# EAGLE design XMICRO-LPA V1.0 (EAGLE 6.3)
PROJECT_NAME: XMICRO-LPA; PROJECT_REVISION: 1.0
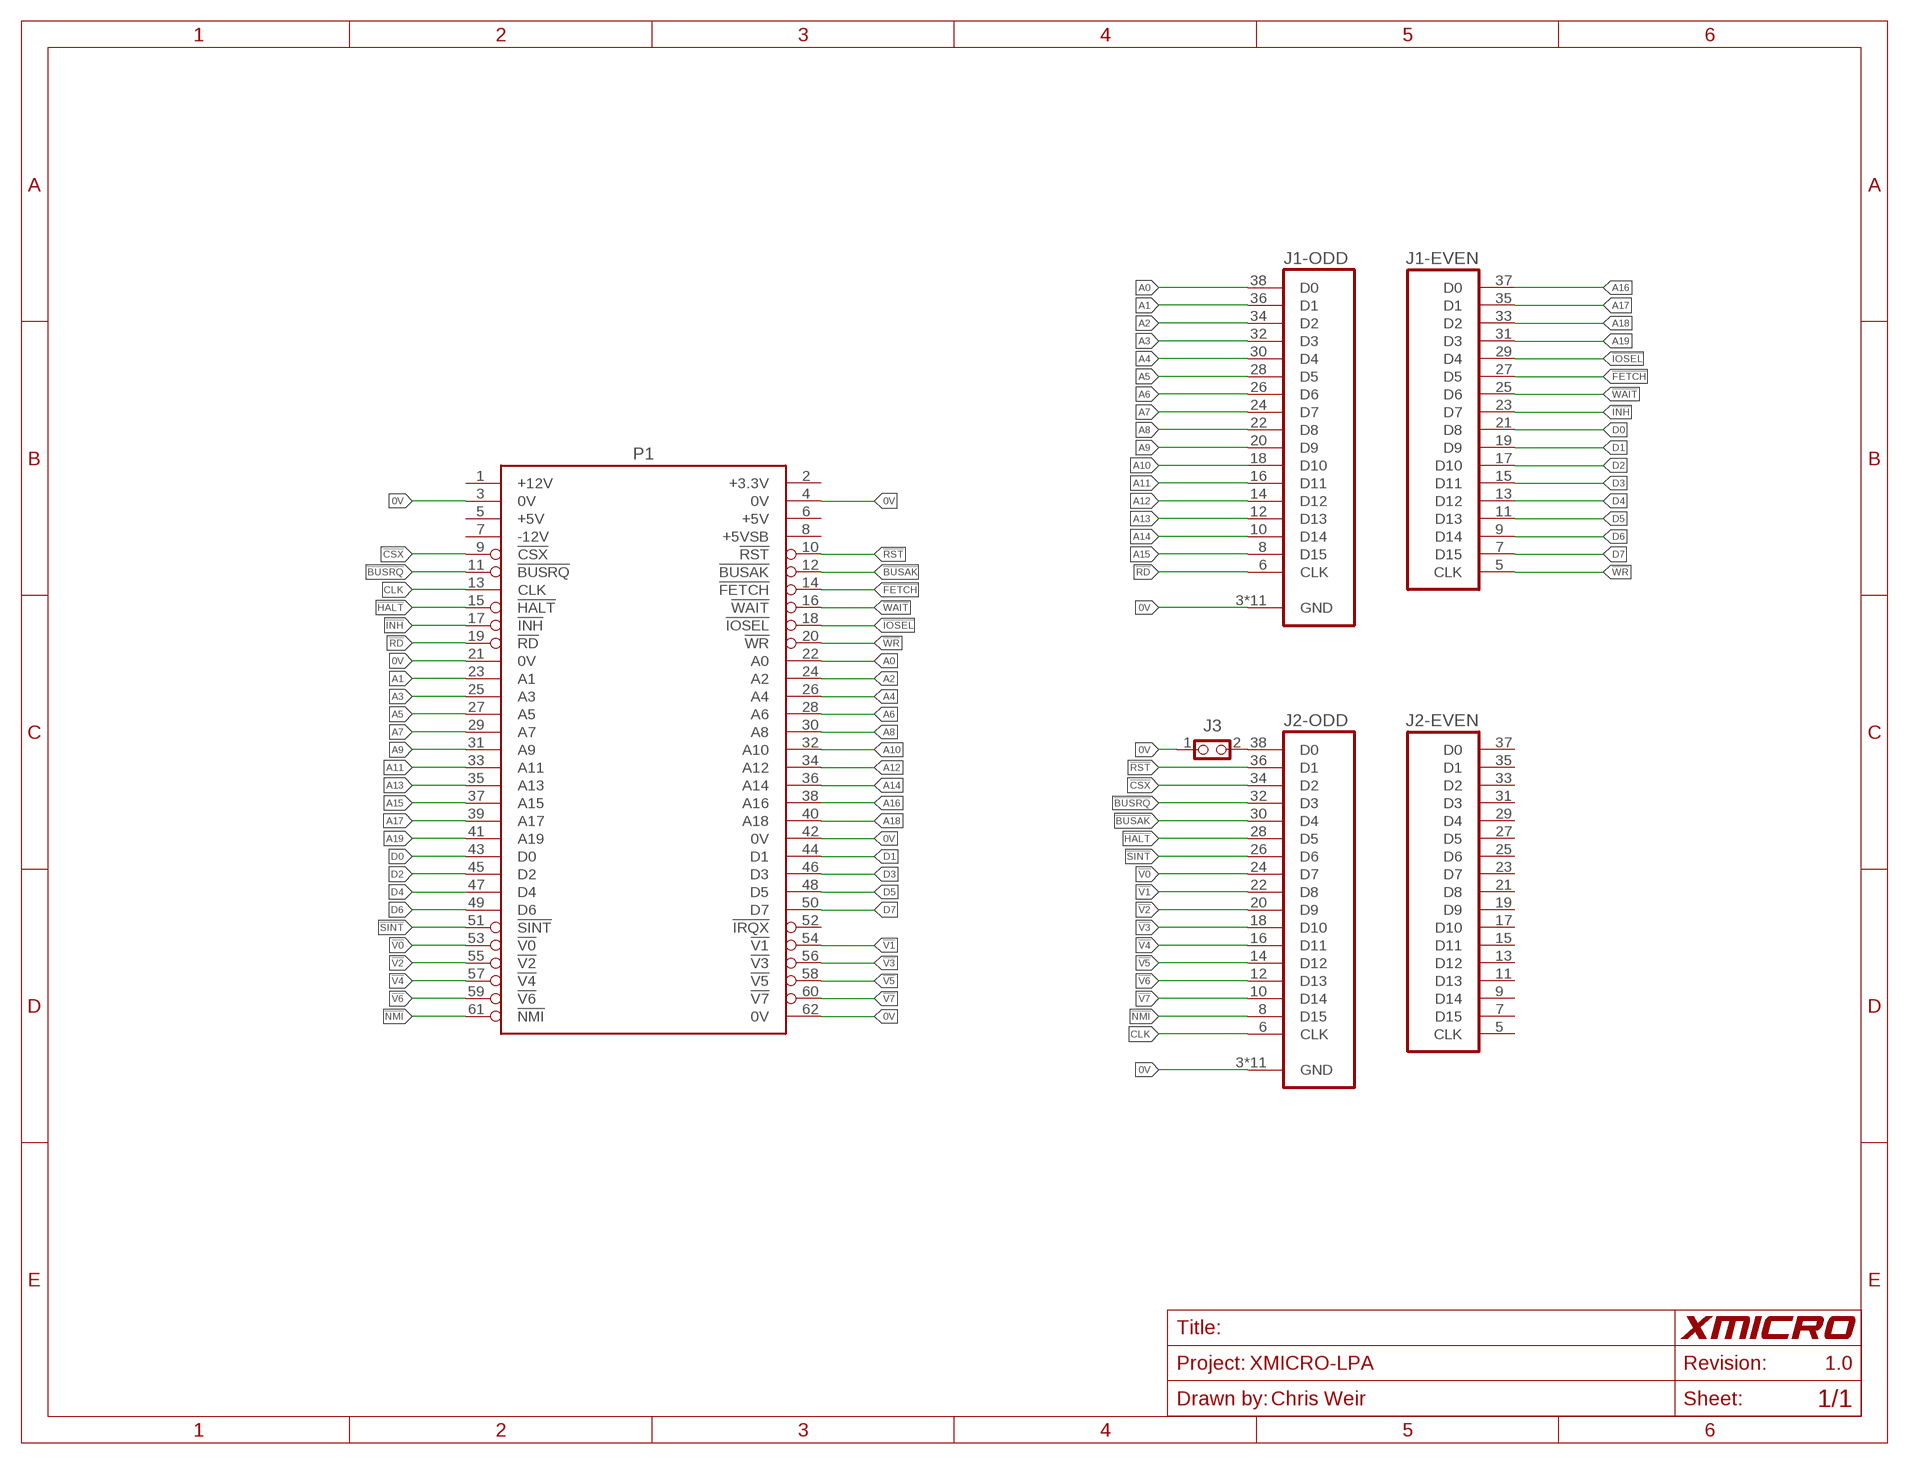
[diagram p0: schematic, sheet 1]
FRAME1 (LETTER): DRAWN_BY: Chris Weir

## Parts
J1  LA-34MEB  [5767089-1B]
J2  LA-34MEB  [5767089-1B]
J3  1X2-THRU  [1X2]
P1  XMICRO-BUS-PHYSICAL-M  [EDGE62M]

## Nets
0V [SUPPLY]: J1.3(-ODD:GND) J1.G1(-ODD:GND) J1.G2(-ODD:GND) J1.G3(-ODD:GND) J1.G4(-ODD:GND) J1.G5(-ODD:GND) J1.G6(-ODD:GND) J1.G7(-ODD:GND) J1.G8(-ODD:GND) J1.G9(-ODD:GND) J1.G10(-ODD:GND) J2.3(-ODD:GND) J2.G1(-ODD:GND) J2.G2(-ODD:GND) J2.G3(-ODD:GND) J2.G4(-ODD:GND) J2.G5(-ODD:GND) J2.G6(-ODD:GND) J2.G7(-ODD:GND) J2.G8(-ODD:GND) J2.G9(-ODD:GND) J2.G10(-ODD:GND) J3.1 P1.3(0V) P1.4(0V) P1.21(0V) P1.42(0V) P1.62(0V)
!BUSAK: J2.30(-ODD:D4) P1.12(!BUSAK)
!BUSRQ: J2.32(-ODD:D3) P1.11(!BUSRQ)
!CSX: J2.34(-ODD:D2) P1.9(!CSX)
!FETCH: J1.27(-EVEN:D5) P1.14(!FETCH)
!HALT: J2.28(-ODD:D5) P1.15(!HALT)
!INH: J1.23(-EVEN:D7) P1.17(!INH)
!IOSEL: J1.29(-EVEN:D4) P1.18(!IOSEL)
!NMI: J2.8(-ODD:D15) P1.61(!NMI)
!RD: J1.6(-ODD:CLK) P1.19(!RD)
!RST: J2.36(-ODD:D1) P1.10(!RST)
!SINT: J2.26(-ODD:D6) P1.51(!SINT)
!V0: J2.24(-ODD:D7) P1.53(!V0)
!V1: J2.22(-ODD:D8) P1.54(!V1)
!V2: J2.20(-ODD:D9) P1.55(!V2)
!V3: J2.18(-ODD:D10) P1.56(!V3)
!V4: J2.16(-ODD:D11) P1.57(!V4)
!V5: J2.14(-ODD:D12) P1.58(!V5)
!V6: J2.12(-ODD:D13) P1.59(!V6)
!V7: J2.10(-ODD:D14) P1.60(!V7)
!WAIT: J1.25(-EVEN:D6) P1.16(!WAIT)
!WR: J1.5(-EVEN:CLK) P1.20(!WR)
A0: J1.38(-ODD:D0) P1.22(A0)
A1: J1.36(-ODD:D1) P1.23(A1)
A2: J1.34(-ODD:D2) P1.24(A2)
A3: J1.32(-ODD:D3) P1.25(A3)
A4: J1.30(-ODD:D4) P1.26(A4)
A5: J1.28(-ODD:D5) P1.27(A5)
A6: J1.26(-ODD:D6) P1.28(A6)
A7: J1.24(-ODD:D7) P1.29(A7)
A8: J1.22(-ODD:D8) P1.30(A8)
A9: J1.20(-ODD:D9) P1.31(A9)
A10: J1.18(-ODD:D10) P1.32(A10)
A11: J1.16(-ODD:D11) P1.33(A11)
A12: J1.14(-ODD:D12) P1.34(A12)
A13: J1.12(-ODD:D13) P1.35(A13)
A14: J1.10(-ODD:D14) P1.36(A14)
A15: J1.8(-ODD:D15) P1.37(A15)
A16: J1.37(-EVEN:D0) P1.38(A16)
A17: J1.35(-EVEN:D1) P1.39(A17)
A18: J1.33(-EVEN:D2) P1.40(A18)
A19: J1.31(-EVEN:D3) P1.41(A19)
CLK: J2.6(-ODD:CLK) P1.13(CLK)
D0: J1.21(-EVEN:D8) P1.43(D0)
D1: J1.19(-EVEN:D9) P1.44(D1)
D2: J1.17(-EVEN:D10) P1.45(D2)
D3: J1.15(-EVEN:D11) P1.46(D3)
D4: J1.13(-EVEN:D12) P1.47(D4)
D5: J1.11(-EVEN:D13) P1.48(D5)
D6: J1.9(-EVEN:D14) P1.49(D6)
D7: J1.7(-EVEN:D15) P1.50(D7)
N$2: J2.38(-ODD:D0) J3.2
Unconnected: J2.5(-EVEN:CLK) J2.7(-EVEN:D15) J2.9(-EVEN:D14) J2.11(-EVEN:D13) J2.13(-EVEN:D12) J2.15(-EVEN:D11) J2.17(-EVEN:D10) J2.19(-EVEN:D9) J2.21(-EVEN:D8) J2.23(-EVEN:D7) J2.25(-EVEN:D6) J2.27(-EVEN:D5) J2.29(-EVEN:D4) J2.31(-EVEN:D3) J2.33(-EVEN:D2) J2.35(-EVEN:D1) J2.37(-EVEN:D0) P1.1(+12V) P1.2(+3.3V) P1.5(+5V) P1.6(+5V) P1.7(-12V) P1.8(+5VSB) P1.52(!IRQX)

## Library data of the parts
J1 J2 = connector-misc:LA-34: Agilent Logic Analyzer Probe - Dual-Pod
J3 = header:1X2-THRU
P1 = xmicro:XMICRO-BUS-PHYSICAL: XMICRO Bus Symbol with physical pin arrangement

## Net classes
1 SUPPLY: width 0.254 mm, clearance 0.203 mm

## Board
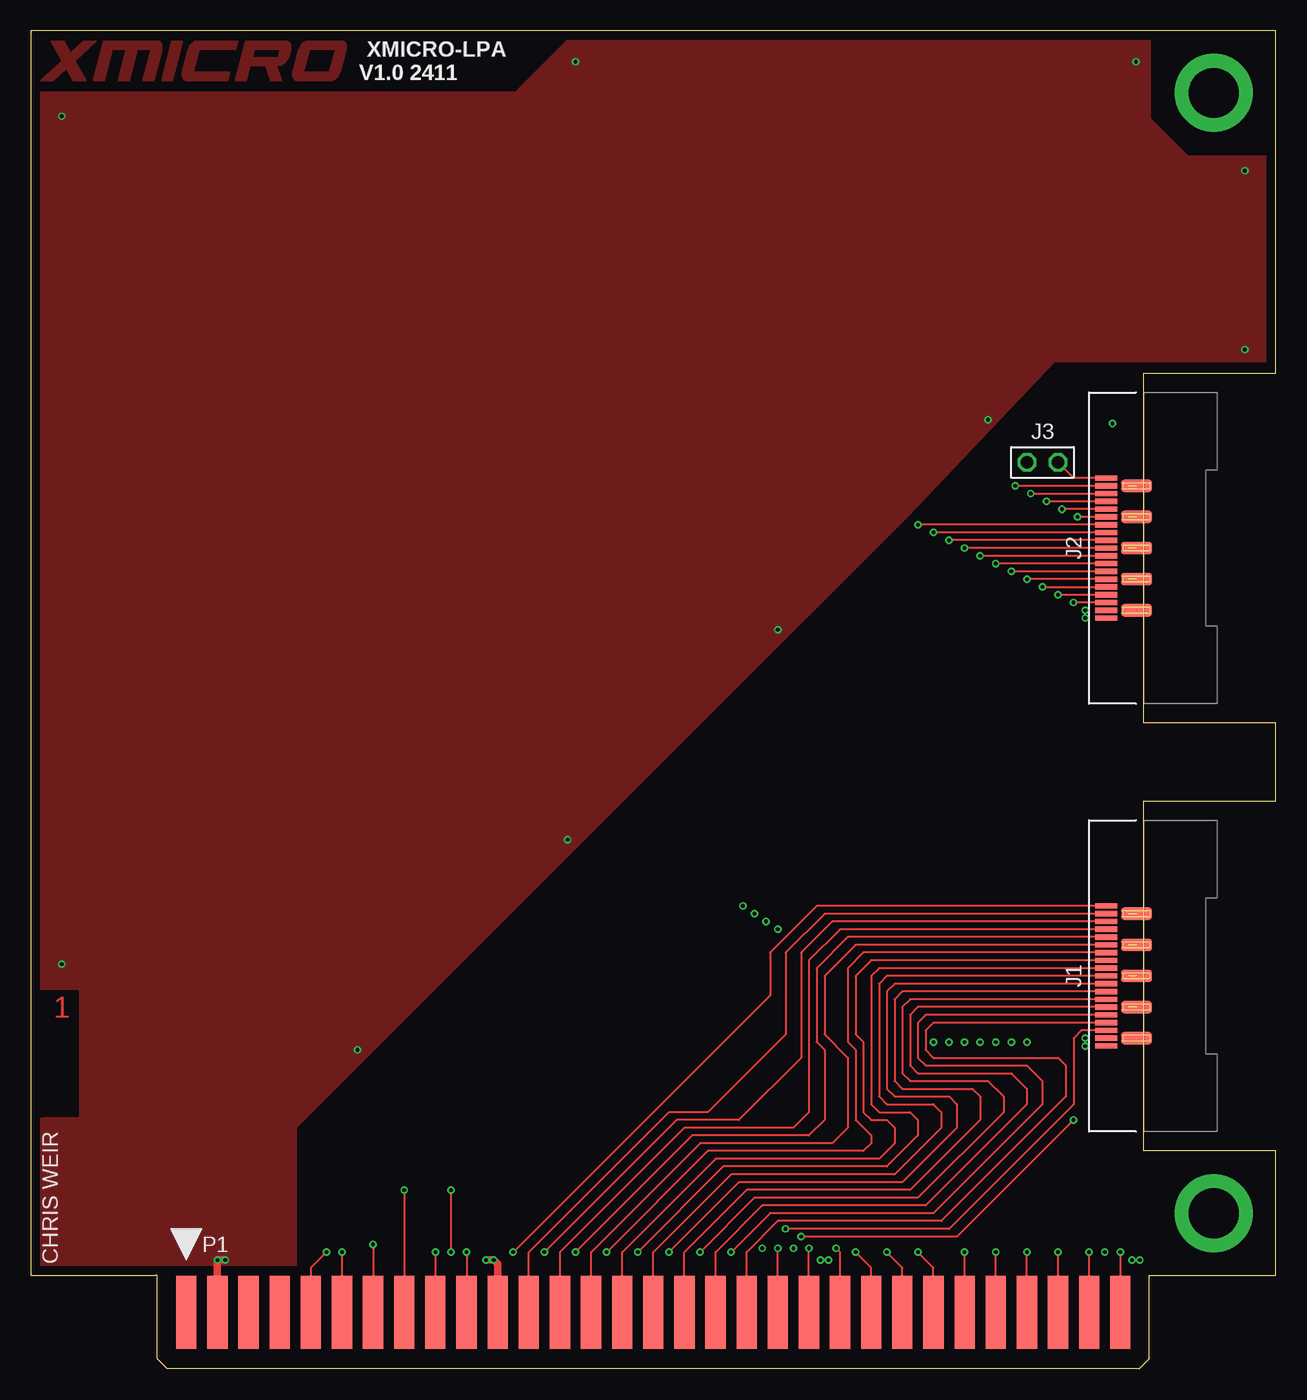
[diagram p1: board, top side]
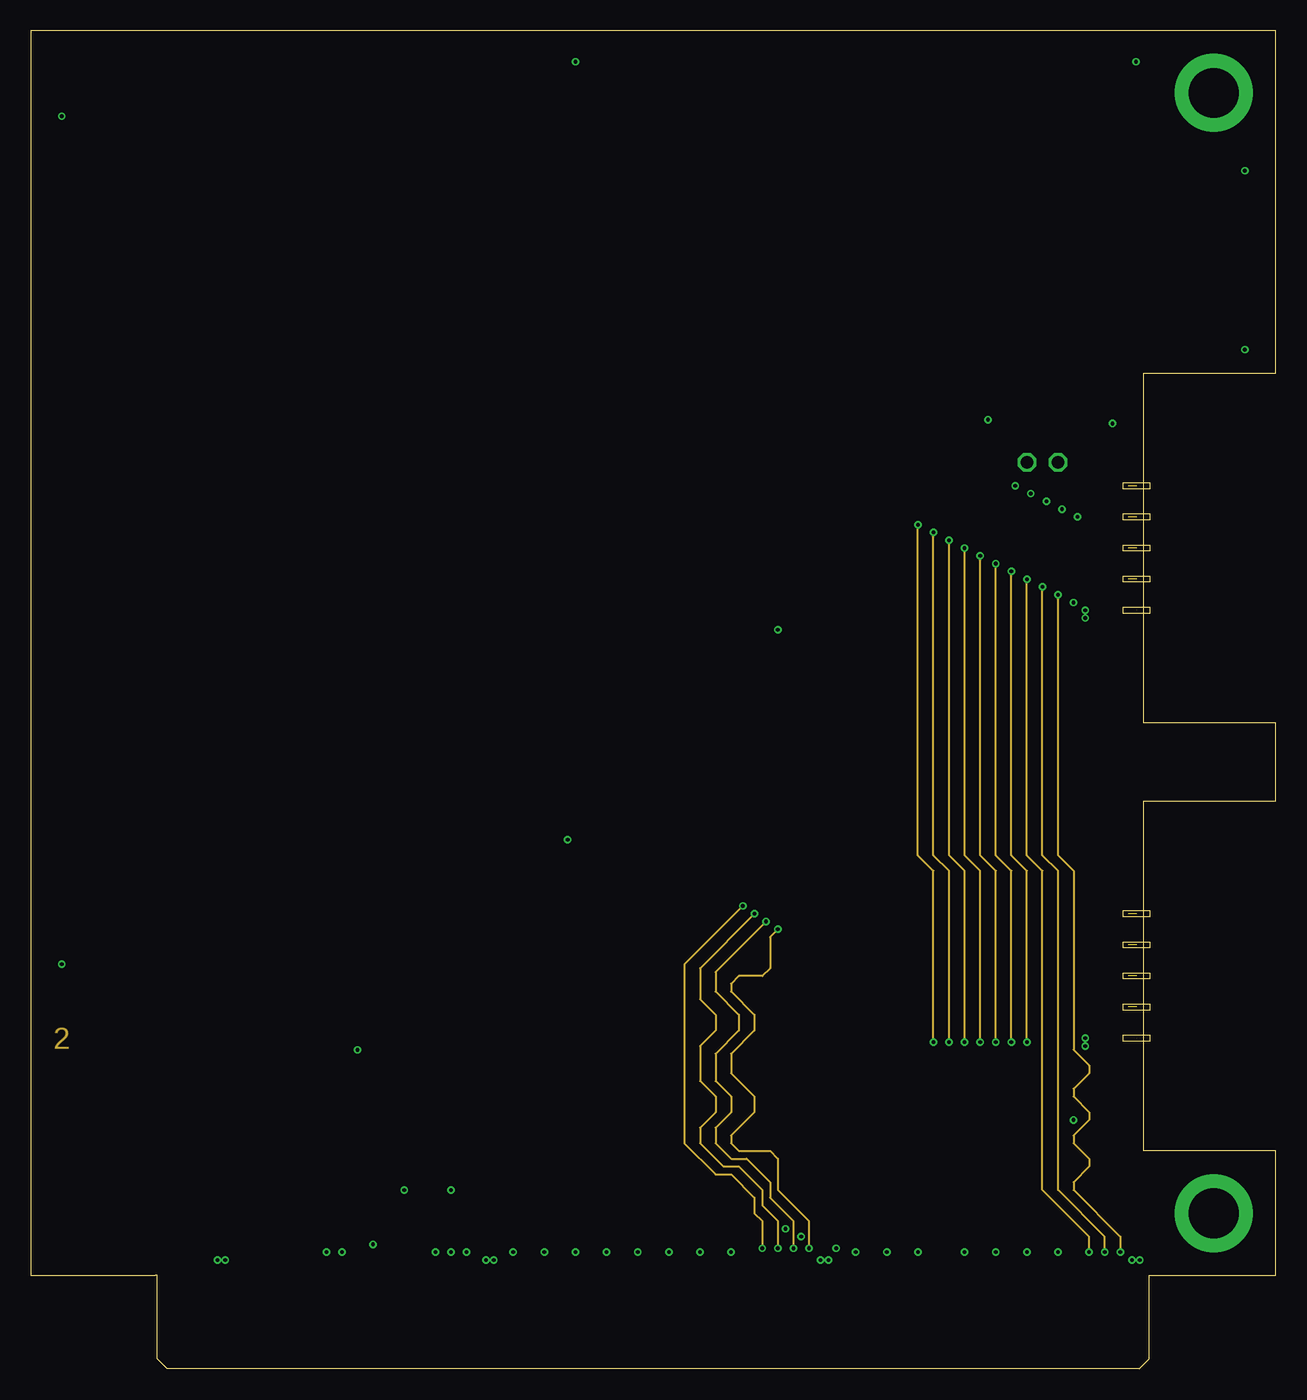
[diagram p2: board, inner layer Route2]
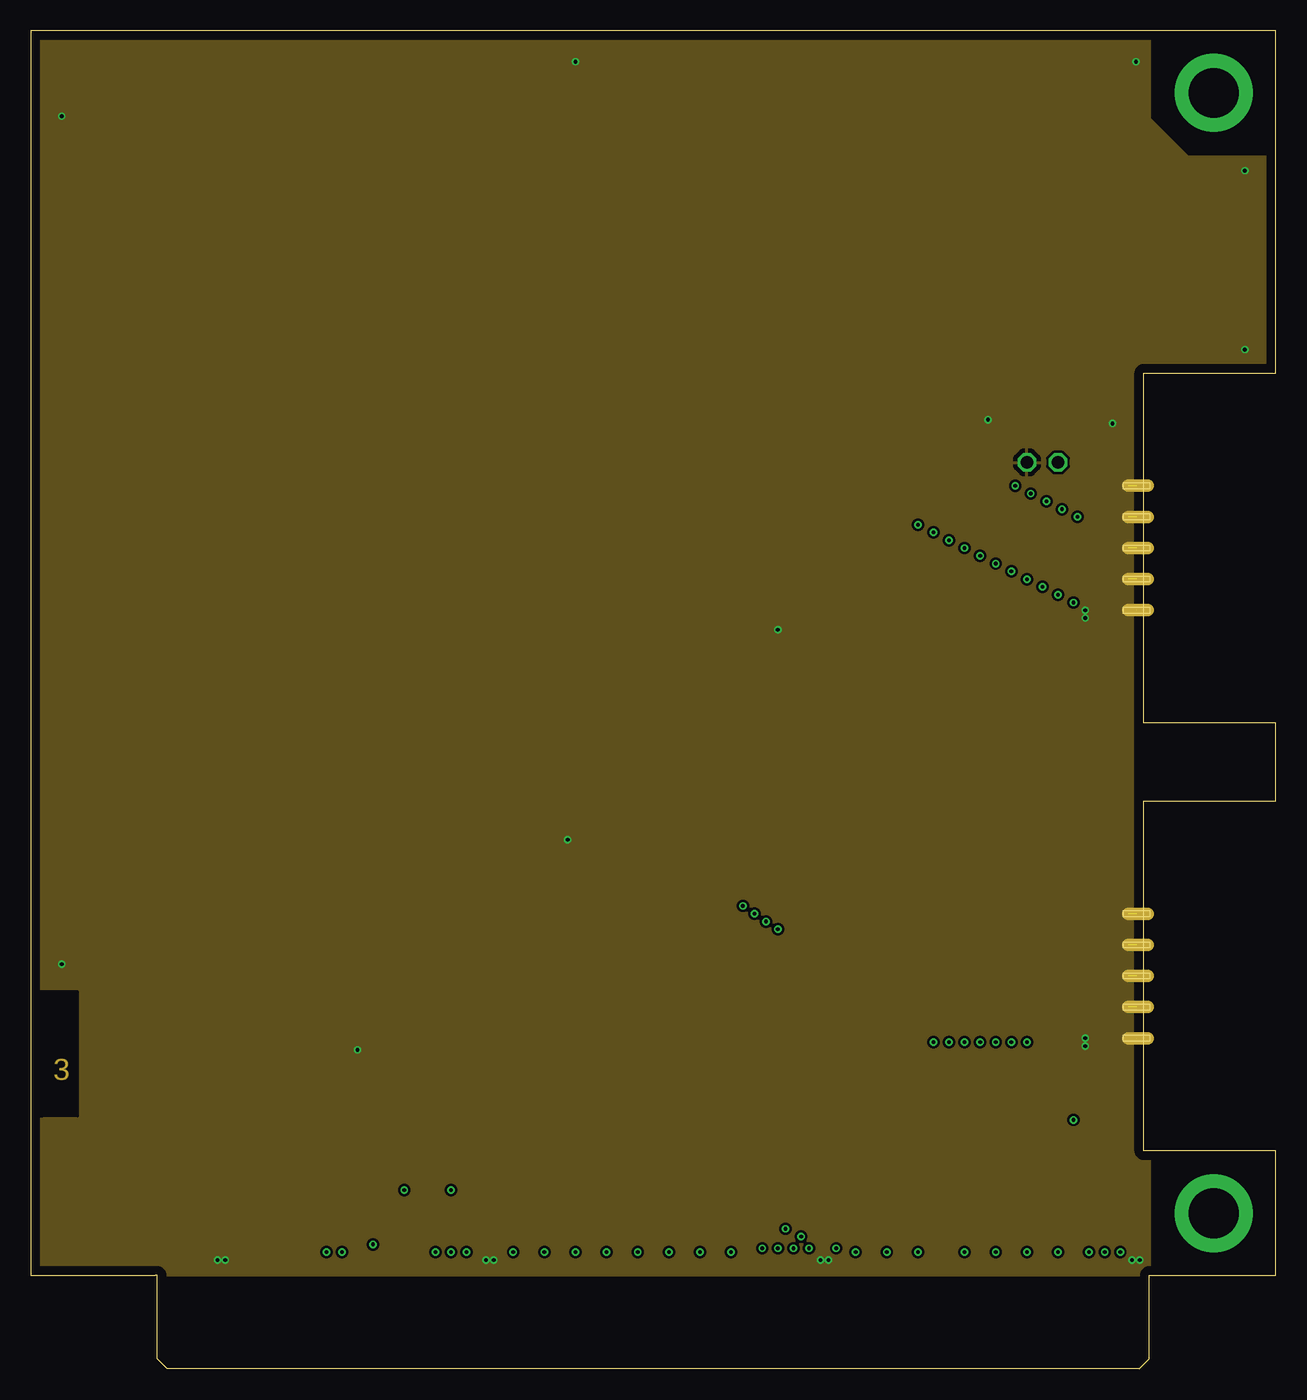
[diagram p3: board, inner layer Route15]
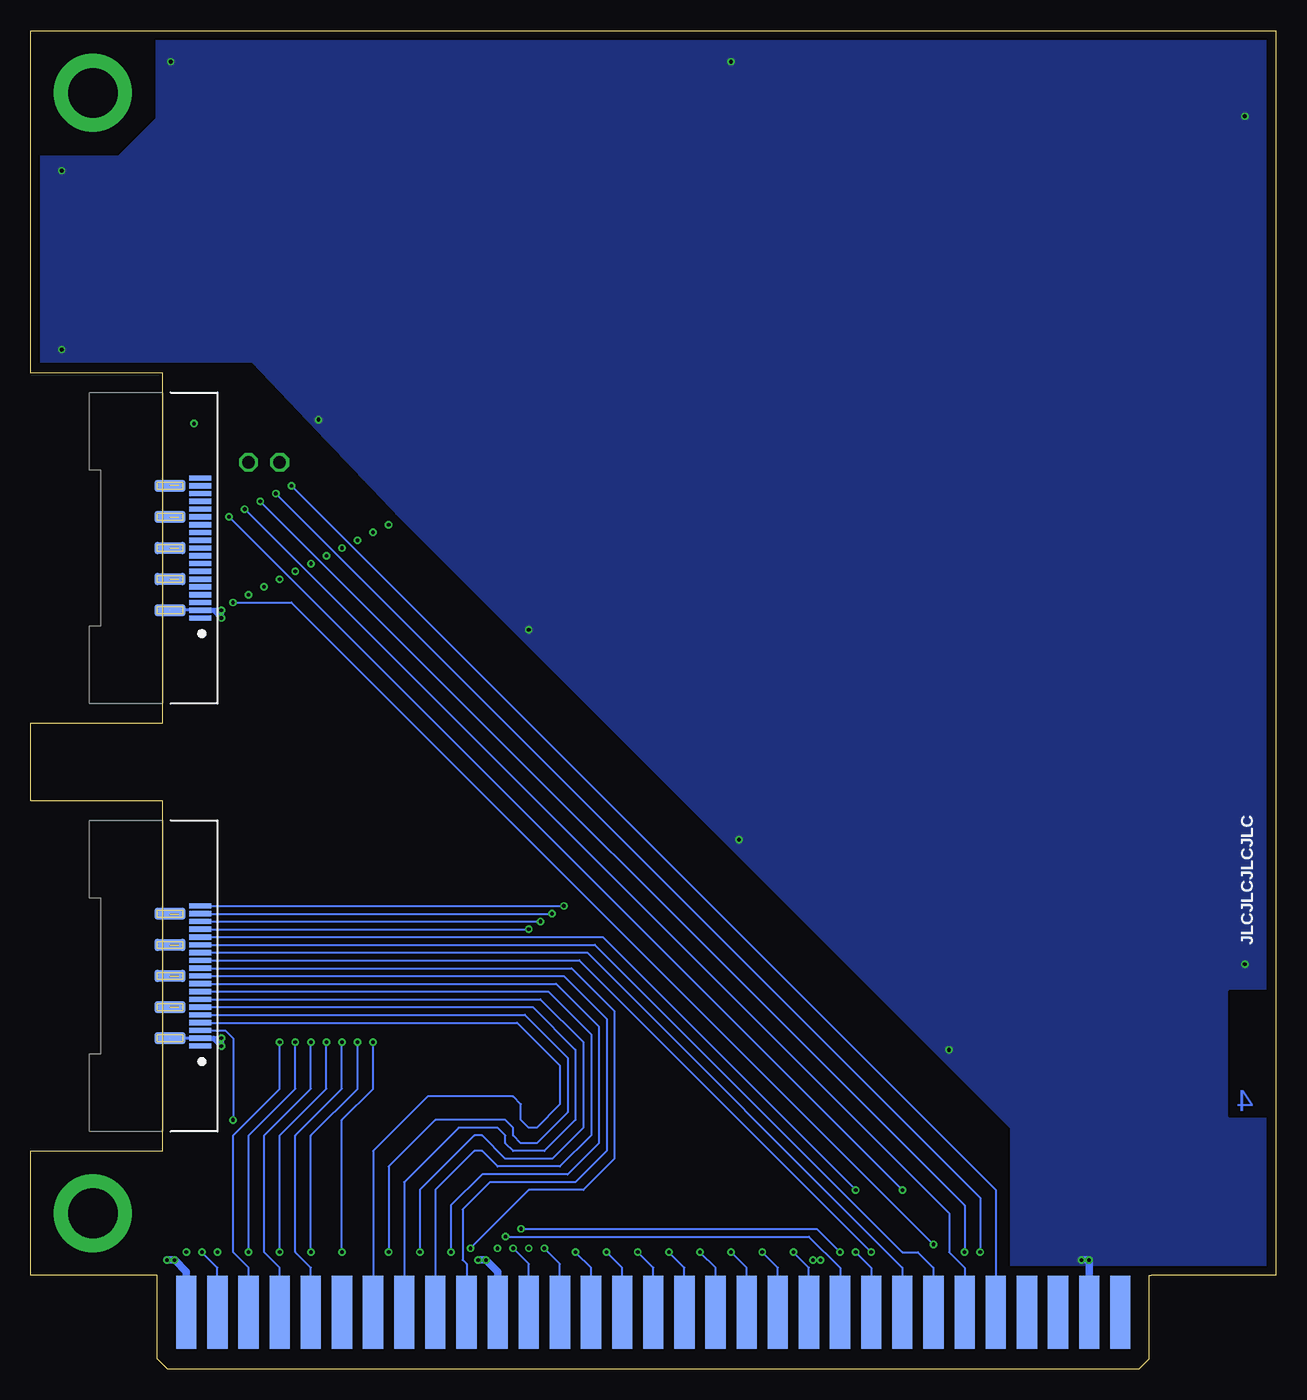
[diagram p4: board, bottom side, seen from below]

Size 101.6 x 109.22 mm. Coordinates in mm from the lower left corner, seen from the top.
Outline: 10.16,7.62 0,7.62 0,109.22 101.6,109.22 101.6,81.28 90.81,81.28 90.81,52.7 101.6,52.7 101.6,46.35 90.81,46.35 90.81,17.78 101.6,17.78 101.6,7.62 91.44,7.62
Copper layers (1+2*15+16): Top 0.035mm / dielectric 0.2mm / Route2 0.0175mm / dielectric 1.065mm / Route15 0.0175mm / dielectric 0.2mm / Bottom 0.035mm
Design rules "JLCPCB 4-Layer *": minimum track width 5mil, minimum drill 0.2mm, track to track 8mil, track to pad 8mil, pad to pad 8mil, via to via 8mil, smd to smd 8mil, copper to edge 30mil, drill to drill 0.26mm, minimum pad ring 10mil, minimum via ring 6mil, stop-mask expansion 1.5mil, vias tented up to drill 25mil, thermal gap 15mil
tKeepout: area 0,107.6 to 101.6,109.2
tRestrict: area 91.4,99.1 to 101.6,109.2; area 10.3,0 to 91.3,8.4; area 91.3,7.6 to 101.6,17.8; 4 lines
bRestrict: area 91.3,7.6 to 101.6,17.8; area 91.4,99.1 to 101.6,109.2; area 10.3,0 to 91.3,8.4

### Footprints (pad centres in the part's own frame; a part is rotated, then mirrored left to right if it is on the bottom)
5767089-1B = smd 0.432 x 1.778 bottom: 1 5.715,-3.048; 3 5.08,-3.048; 5 4.445,-3.048; 7 3.81,-3.048; 9 3.175,-3.048; 11 2.54,-3.048; 13 1.905,-3.048; 15 1.27,-3.048; 17 0.635,-3.048; 19 0,-3.048; 21 -0.635,-3.048; 23 -1.27,-3.048; 25 -1.905,-3.048; 27 -2.54,-3.048; 29 -3.175,-3.048; 31 -3.81,-3.048; 33 -4.445,-3.048; 35 -5.08,-3.048; 37 -5.715,-3.048 | smd 0.432 x 1.778: 2 5.715,-3.048; 4 5.08,-3.048; 6 4.445,-3.048; 8 3.81,-3.048; 10 3.175,-3.048; 12 2.54,-3.048; 14 1.905,-3.048; 16 1.27,-3.048; 18 0.635,-3.048; 20 0,-3.048; 22 -0.635,-3.048; 24 -1.27,-3.048; 26 -1.905,-3.048; 28 -2.54,-3.048; 30 -3.175,-3.048; 32 -3.81,-3.048; 34 -4.445,-3.048; 36 -5.08,-3.048; 38 -5.715,-3.048 | smd 1.016 x 2.54 bottom: G1 5.08,-0.572; G4 2.54,-0.572; G6 0,-0.572; G8 -2.54,-0.572; G10 -5.08,-0.572 | smd 1.016 x 2.54: G2 5.08,-0.572; G3 2.54,-0.572; G5 0,-0.572; G7 -2.54,-0.572; G9 -5.08,-0.572
1X2 = drill 1.016 octagon: 1 -1.27,0; 2 1.27,0
EDGE62M = smd 1.651 x 5.969: 1 -38.1,-3.01; 3 -35.56,-3.01; 5 -33.02,-3.01; 7 -30.48,-3.01; 9 -27.94,-3.01; 11 -25.4,-3.01; 13 -22.86,-3.01; 15 -20.32,-3.01; 17 -17.78,-3.01; 19 -15.24,-3.01; 21 -12.7,-3.01; 23 -10.16,-3.01; 25 -7.62,-3.01; 27 -5.08,-3.01; 29 -2.54,-3.01; 31 0,-3.01; 33 2.54,-3.01; 35 5.08,-3.01; 37 7.62,-3.01; 39 10.16,-3.01; 41 12.7,-3.01; 43 15.24,-3.01; 45 17.78,-3.01; 47 20.32,-3.01; 49 22.86,-3.01; 51 25.4,-3.01; 53 27.94,-3.01; 55 30.48,-3.01; 57 33.02,-3.01; 59 35.56,-3.01; 61 38.1,-3.01 | smd 1.651 x 5.969 bottom: 2 -38.1,-3.01; 4 -35.56,-3.01; 6 -33.02,-3.01; 8 -30.48,-3.01; 10 -27.94,-3.01; 12 -25.4,-3.01; 14 -22.86,-3.01; 16 -20.32,-3.01; 18 -17.78,-3.01; 20 -15.24,-3.01; 22 -12.7,-3.01; 24 -10.16,-3.01; 26 -7.62,-3.01; 28 -5.08,-3.01; 30 -2.54,-3.01; 32 0,-3.01; 34 2.54,-3.01; 36 5.08,-3.01; 38 7.62,-3.01; 40 10.16,-3.01; 42 12.7,-3.01; 44 15.24,-3.01; 46 17.78,-3.01; 48 20.32,-3.01; 50 22.86,-3.01; 52 25.4,-3.01; 54 27.94,-3.01; 56 30.48,-3.01; 58 33.02,-3.01; 60 35.56,-3.01; 62 38.1,-3.01

### Placement (x,y rotation side)
J1  90.81,32.07 270 top
J2  90.81,66.99 270 top
J3  82.55,73.98 0 top
P1  50.8,7.62 0 top

### Tracks (layer width: path | path; a pad name or v marks a point on that pad's centre or on a via)
0V  (via drill 0.3)  (18 unrouted)
  Top 0.61: P1.21 38.1,8.57 v37.78,8.89 v37.15,8.89 | P1.3 v15.24,8.89 v15.88,8.89
  Route15 1.016: 89.53,72.07 91.12,72.07 | 89.53,69.53 91.12,69.53 | 89.53,66.99 91.12,66.99 | 89.53,64.45 91.12,64.45 | 89.53,61.91 91.12,61.91 | 89.53,37.15 91.12,37.15 | 89.53,34.61 91.12,34.61 | 89.53,32.07 91.12,32.07 | 89.53,29.53 91.12,29.53 | 89.53,26.99 91.12,26.99
  Bottom 0.254: J1.3 J1.G1 | J2.3 J2.G1
  Bottom 0.406: J1.3 86.68,26.99 | 86.68,26.99 v86.04,26.99 v86.04,26.35 86.68,26.99 | J2.3 86.68,61.91 | 86.68,61.91 v86.04,61.91 v86.04,61.28 86.68,61.91
  Bottom 0.61: v65.09,8.89 v64.45,8.89 63.5,7.94 P1.42 | P1.62 88.9,7.94 v89.85,8.89 v90.49,8.89 | P1.3 v15.24,8.89 v15.88,8.89
  other vias: 2.54,102.23 44.45,106.68 90.17,106.68 99.06,97.79 43.81,43.18 88.27,77.15 26.67,26.04 2.54,33.02 99.06,83.19 60.96,60.32 78.11,77.47
  pour Route15 (rank 3): 0,109.22 101.6,109.22 101.6,81.28 90.81,81.28 90.81,17.78 101.6,17.78 101.6,7.62 0,7.62
  pour Bottom (rank 3): 0,109.22 101.6,109.22 101.6,82.23 83.5,82.23 71.44,69.53 21.59,19.68 21.59,7.62 0,7.62
  pour Top (rank 3): 0,109.22 101.6,109.22 101.6,82.23 83.5,82.23 71.44,69.53 21.59,19.68 21.59,7.62 0,7.62
!BUSAK  (via drill 0.3)
  Top 0.152: J2.30 v84.14,70.17
  Bottom 0.152: v84.14,70.17 26.67,12.7 26.67,9.53 25.4,8.26 P1.12
!BUSRQ  (via drill 0.3)
  Top 0.152: J2.32 v82.87,70.8 | v25.4,9.53 P1.11
  Bottom 0.152: v82.87,70.8 25.4,13.34 v25.4,9.53
!CSX  (via drill 0.3)
  Top 0.152: v81.6,71.44 J2.34 | v24.13,9.53 22.86,8.26 P1.9
  Bottom 0.152: v81.6,71.44 24.13,13.97 v24.13,9.53
!FETCH
  Bottom 0.152: J1.27 55.56,34.61 30.48,9.53 29.21,9.53 27.94,8.26 P1.14
!HALT  (via drill 0.3)
  Top 0.152: J2.28 v85.41,69.53 | v30.48,14.61 P1.15
  Bottom 0.152: v85.41,69.53 v30.48,14.61
!INH  (via drill 0.3)
  Top 0.152: v33.02,9.53 P1.17
  Bottom 0.152: J1.23 56.83,33.34 v33.02,9.53
!IOSEL  (via drill 0.3)
  Top 0.152: v34.29,14.61 v34.29,9.53
  Bottom 0.152: J1.29 54.93,35.24 v34.29,14.61 | v34.29,9.53 33.02,8.26 P1.18
!NMI  (via drill 0.3)
  Top 0.152: v83.82,63.18 J2.8 | v88.9,9.53 P1.61
  Route2 0.152: v83.82,63.18 83.82,41.91 85.09,40.64 85.09,26.04 86.36,24.77 86.36,24.13 85.09,22.86 85.09,22.23 86.36,20.96 86.36,20.32 85.09,19.05 85.09,18.41 86.36,17.14 86.36,16.51 85.09,15.24 85.09,14.61 88.9,10.79 v88.9,9.53
!RD  (via drill 0.3)
  Top 0.152: J1.6 85.72,27.62 85.09,26.99 85.09,21.59 74.93,11.43 v61.59,11.43 | v35.56,9.53 P1.19
  Bottom 0.152: v61.59,11.43 37.47,11.43 v35.56,9.53
!RST  (via drill 0.3)
  Top 0.152: v80.33,72.07 J2.36
  Bottom 0.152: v80.33,72.07 22.86,14.61 P1.10
!SINT  (via drill 0.3)
  Top 0.152: P1.51 v76.2,9.53 | J2.26 v72.39,68.9
  Route2 0.152: v73.66,26.67 73.66,40.64 72.39,41.91 v72.39,68.9
  Bottom 0.152: v76.2,9.53 76.2,20.32 73.66,22.86 v73.66,26.67
!V0  (via drill 0.3)
  Top 0.152: P1.53 v78.74,9.53 | J2.24 v73.66,68.26
  Route2 0.152: v74.93,26.67 74.93,40.64 73.66,41.91 v73.66,68.26
  Bottom 0.152: v78.74,9.53 78.74,19.05 74.93,22.86 v74.93,26.67
!V1  (via drill 0.3)
  Top 0.152: J2.22 v74.93,67.63
  Route2 0.152: v76.2,26.67 76.2,40.64 74.93,41.91 v74.93,67.63
  Bottom 0.152: P1.54 78.74,8.26 80.01,9.53 80.01,19.05 76.2,22.86 v76.2,26.67
!V2  (via drill 0.3)
  Top 0.152: P1.55 v81.28,9.53 | J2.20 v76.2,66.99
  Route2 0.152: v77.47,26.67 77.47,40.64 76.2,41.91 v76.2,66.99
  Bottom 0.152: v81.28,9.53 81.28,19.05 77.47,22.86 v77.47,26.67
!V3  (via drill 0.3)
  Top 0.152: J2.18 v77.47,66.36
  Route2 0.152: v78.74,26.67 78.74,40.64 77.47,41.91 v77.47,66.36
  Bottom 0.152: P1.56 81.28,8.26 82.55,9.53 82.55,19.05 78.74,22.86 v78.74,26.67
!V4  (via drill 0.3)
  Top 0.152: P1.57 v83.82,9.53 | J2.16 v78.74,65.72
  Route2 0.152: v80.01,26.67 80.01,40.64 78.74,41.91 v78.74,65.72
  Bottom 0.152: v83.82,9.53 83.82,19.05 80.01,22.86 v80.01,26.67
!V5  (via drill 0.3)
  Top 0.152: J2.14 v80.01,65.09
  Route2 0.152: v81.28,26.67 81.28,40.64 80.01,41.91 v80.01,65.09
  Bottom 0.152: P1.58 83.82,8.26 85.09,9.53 85.09,19.05 81.28,22.86 v81.28,26.67
!V6  (via drill 0.3)
  Top 0.152: P1.59 v86.36,9.53 | J2.12 v81.28,64.45
  Route2 0.152: v86.36,9.53 86.36,10.79 82.55,14.61 82.55,40.64 81.28,41.91 v81.28,64.45
!V7  (via drill 0.3)
  Top 0.152: v82.55,63.82 J2.10
  Route2 0.152: v87.63,9.53 87.63,10.79 83.82,14.61 83.82,40.64 82.55,41.91 v82.55,63.82
  Bottom 0.152: P1.60 86.36,8.26 v87.63,9.53
!WAIT
  Bottom 0.152: J1.25 56.2,33.97 30.48,8.26 P1.16
!WR  (via drill 0.3)
  Top 0.152: v85.09,20.32 75.56,10.79 v62.87,10.79
  Bottom 0.152: J1.5 85.72,27.62 85.09,26.99 v85.09,20.32 | v62.87,10.79 38.1,10.79 35.56,8.26 P1.20
A0  (via drill 0.3)
  Top 0.152: J1.38 64.14,37.78 60.33,33.97 60.33,30.48 v39.37,9.53
  Bottom 0.152: P1.22 38.1,8.26 v39.37,9.53
A1
  Top 0.152: J1.36 64.77,37.15 61.59,33.97 61.59,27.3 55.24,20.96 52.07,20.96 40.64,9.53 P1.23
A2  (via drill 0.3)
  Top 0.152: J1.34 65.41,36.51 62.87,33.97 62.87,25.4 57.78,20.32 52.7,20.32 v41.91,9.53
  Bottom 0.152: P1.24 40.64,8.26 v41.91,9.53
A3
  Top 0.152: J1.32 66.04,35.88 63.5,33.34 63.5,20.96 62.23,19.68 53.34,19.68 43.18,9.53 P1.25
A4  (via drill 0.3)
  Top 0.152: J1.30 66.67,35.24 64.14,32.7 64.14,26.67 64.77,26.04 64.77,20.32 63.5,19.05 53.98,19.05 v44.45,9.53
  Bottom 0.152: P1.26 43.18,8.26 v44.45,9.53
A5
  Top 0.152: J1.28 67.31,34.61 64.77,32.07 64.77,27.3 66.67,25.4 66.67,19.68 65.41,18.41 54.61,18.41 45.72,9.53 P1.27
A6  (via drill 0.3)
  Top 0.152: J1.26 67.94,33.97 66.67,32.7 66.67,26.67 67.31,26.04 67.31,20.32 68.58,19.05 68.58,18.41 67.94,17.78 55.24,17.78 v46.99,9.53
  Bottom 0.152: P1.28 45.72,8.26 v46.99,9.53
A7
  Top 0.152: J1.24 68.58,33.34 67.31,32.07 67.31,27.3 67.94,26.67 67.94,20.96 68.58,20.32 69.85,20.32 70.48,19.68 70.48,18.41 69.22,17.14 55.88,17.14 48.26,9.53 P1.29
A8  (via drill 0.3)
  Top 0.152: J1.22 69.22,32.7 68.58,32.07 68.58,21.59 69.22,20.96 71.75,20.96 72.39,20.32 72.39,19.05 69.85,16.51 56.52,16.51 v49.53,9.53
  Bottom 0.152: P1.30 48.26,8.26 v49.53,9.53
A9
  Top 0.152: J1.20 69.85,32.07 69.22,31.43 69.22,22.23 69.85,21.59 73.66,21.59 74.3,20.96 74.3,19.68 70.48,15.88 57.15,15.88 50.8,9.53 P1.31
A10  (via drill 0.3)
  Top 0.152: J1.18 70.48,31.43 69.85,30.8 69.85,22.86 70.48,22.23 74.93,22.23 75.56,21.59 75.56,19.68 71.12,15.24 57.78,15.24 v52.07,9.53
  Bottom 0.152: P1.32 50.8,8.26 v52.07,9.53
A11
  Top 0.152: J1.16 71.12,30.8 70.48,30.16 70.48,23.5 71.12,22.86 76.83,22.86 77.47,22.23 77.47,20.32 71.75,14.61 58.42,14.61 53.34,9.53 P1.33
A12  (via drill 0.3)
  Top 0.152: J1.14 71.75,30.16 71.12,29.53 71.12,24.13 71.75,23.5 78.11,23.5 79.38,22.23 79.38,20.96 72.39,13.97 59.05,13.97 v54.61,9.53
  Bottom 0.152: P1.34 53.34,8.26 v54.61,9.53
A13
  Top 0.152: J1.12 72.39,29.53 71.75,28.89 71.75,24.77 72.39,24.13 80.01,24.13 81.28,22.86 81.28,21.59 73.03,13.34 59.69,13.34 55.88,9.53 P1.35
A14  (via drill 0.3)
  Top 0.152: J1.10 73.03,28.89 72.39,28.26 72.39,25.4 73.03,24.77 81.28,24.77 82.55,23.5 82.55,21.59 73.66,12.7 60.33,12.7 v57.15,9.53
  Bottom 0.152: P1.36 55.88,8.26 v57.15,9.53
A15
  Top 0.152: J1.8 73.66,28.26 73.03,27.62 73.03,26.04 73.66,25.4 83.82,25.4 84.45,24.77 84.45,22.23 74.3,12.07 60.96,12.07 58.42,9.53 P1.37
A16  (via drill 0.3)
  Route2 0.152: v58.1,37.78 53.34,33.02 53.34,18.41 55.88,15.88 57.15,15.88 59.05,13.97 59.05,12.7 59.69,12.07 v59.69,9.84
  Bottom 0.152: J1.37 v58.1,37.78 | P1.38 58.42,8.57 v59.69,9.84
A17  (via drill 0.3)
  Top 0.152: P1.39 v60.96,9.84
  Route2 0.152: v59.05,37.15 54.61,32.7 54.61,30.16 55.88,28.89 55.88,27.62 54.61,26.35 54.61,23.5 55.88,22.23 55.88,20.96 54.61,19.68 54.61,18.41 56.52,16.51 57.78,16.51 59.69,14.61 59.69,13.34 60.96,12.07 v60.96,9.84
  Bottom 0.152: J1.35 v59.05,37.15
A18  (via drill 0.3)
  Route2 0.152: v60.01,36.51 55.88,32.38 55.88,30.8 57.78,28.89 57.78,27.62 55.88,25.72 55.88,23.5 57.15,22.23 57.15,20.96 55.88,19.68 55.88,18.41 57.15,17.14 58.42,17.14 60.33,15.24 60.33,13.97 62.23,12.07 v62.23,9.84
  Bottom 0.152: J1.33 v60.01,36.51 | P1.40 60.96,8.57 v62.23,9.84
A19  (via drill 0.3)
  Top 0.152: P1.41 v63.5,9.84
  Route2 0.152: v60.96,35.88 60.33,35.24 60.33,32.7 59.69,32.07 57.78,32.07 57.15,31.43 57.15,30.8 59.05,28.89 59.05,27.62 57.15,25.72 57.15,24.13 59.05,22.23 59.05,20.96 57.15,19.05 57.15,18.41 57.78,17.78 60.33,17.78 60.96,17.14 60.96,14.61 63.5,12.07 v63.5,9.84
  Bottom 0.152: J1.31 v60.96,35.88
CGND1  (via drill 4.06 pad 6.35)
  other vias: 96.52,12.7
  cutout Route2: 101.6,7.62 101.6,17.78 91.44,17.78 91.44,7.62
  cutout Route15: 101.6,7.62 101.6,17.78 91.44,17.78 91.44,7.62
CGND2  (via drill 4.06 pad 6.35)
  other vias: 96.52,104.14
  cutout Route2: 101.6,109.22 91.44,109.22 91.44,102.08 94.46,99.06 101.6,99.06
  cutout Route15: 101.6,109.22 91.44,109.22 91.44,102.08 94.46,99.06 101.6,99.06
CLK  (via drill 0.3)
  Top 0.152: J2.6 v85.09,62.55 | v27.94,10.16 P1.13
  Bottom 0.152: v85.09,62.55 80.33,62.55 v27.94,10.16
D0  (via drill 0.3)
  Top 0.152: P1.43 66.04,9.53 v65.72,9.84
  Bottom 0.152: J1.21 57.47,32.7 53.98,29.21 53.98,17.14 56.52,14.61 60.96,14.61 v65.72,9.84
D1
  Bottom 0.152: J1.19 58.1,32.07 54.61,28.57 54.61,17.78 57.15,15.24 64.14,15.24 66.36,13.02 66.36,8.89 66.04,8.57 P1.44
D2  (via drill 0.3)
  Top 0.152: P1.45 68.58,8.26 v67.31,9.53
  Bottom 0.152: J1.17 58.74,31.43 55.24,27.94 55.24,18.41 57.78,15.88 64.77,15.88 67.31,13.34 v67.31,9.53
D3
  Bottom 0.152: J1.15 59.37,30.8 55.88,27.3 55.88,19.05 58.42,16.51 63.5,16.51 64.77,17.78 65.41,17.78 68.58,14.61 P1.46
D4  (via drill 0.3)
  Top 0.152: P1.47 71.12,8.26 v69.85,9.53
  Bottom 0.152: J1.13 60.01,30.16 56.52,26.67 56.52,19.68 59.05,17.14 62.87,17.14 64.77,19.05 65.41,19.05 69.85,14.61 v69.85,9.53
D5
  Bottom 0.152: J1.11 60.64,29.53 57.15,26.04 57.15,20.32 59.69,17.78 62.23,17.78 62.87,18.41 62.87,19.05 63.5,19.68 66.67,19.68 71.12,15.24 P1.48
D6  (via drill 0.3)
  Top 0.152: P1.49 73.66,8.26 v72.39,9.53
  Bottom 0.152: J1.9 61.28,28.89 57.78,25.4 57.78,20.96 60.33,18.41 61.59,18.41 62.23,19.05 62.23,19.68 62.87,20.32 68.58,20.32 72.39,16.51 v72.39,9.53
D7
  Bottom 0.152: J1.7 61.91,28.26 58.42,24.77 58.42,21.59 60.33,19.68 60.96,19.68 61.59,20.32 61.59,21.59 62.23,22.23 69.22,22.23 73.66,17.78 P1.50
LOGO-C
  pour Top (no thermals): 16.9,108.39 16.74,107.71 13.74,107.71 13.26,105.83 16.24,105.83 16.07,105.14 12.78,105.14 arc-47 12.52,105.25 arc-36 12.38,105.57 arc-17 12.39,105.83 arc-5 12.41,105.98 12.82,107.56 arc-33 13.18,108.16 arc-31 13.56,108.38 arc-13 13.7,108.39
LOGO-I
  pour Top (no thermals): 11.52,108.39 12.4,108.39 11.55,105.14 10.68,105.14
LOGO-M
  pour Top (no thermals): 5.12,105.14 5.96,108.39 10.24,108.39 arc-50 10.58,108.27 arc-37 10.71,107.98 arc-17 10.68,107.6 10.04,105.14 9.16,105.14 9.83,107.71 8.69,107.71 8.03,105.14 7.14,105.14 7.81,107.71 6.67,107.71 6.01,105.14
LOGO-O
  pour Top (no thermals): 22.78,107.71 24.88,107.71 24.38,105.83 22.26,105.83 22.76,107.71 22.81,108.39 22.7,108.39 arc33 22.31,108.26 arc19 22.02,107.94 arc18 21.85,107.56 21.42,105.96 arc9 21.4,105.86 arc9 21.39,105.62 arc22 21.44,105.41 arc36 21.56,105.23 arc17 21.69,105.16 arc13 21.83,105.14 24.4,105.14 arc18 24.61,105.16 arc16 24.8,105.26 arc14 25.03,105.48 arc26 25.29,105.94 25.72,107.62 arc17 25.74,107.9 arc19 25.7,108.12 arc66 25.32,108.39 22.83,108.39
LOGO-R
  pour Top (no thermals): 17.55,108.39 18.25,107.71 18.08,107 20.19,107 20.36,107.71 18.28,107.71 17.58,108.39 20.71,108.39 arc-55 21.13,108.19 arc-31 21.24,107.93 arc-18 21.21,107.6 21.1,107.19 arc-18 21.02,107.01 arc-18 20.7,106.61 arc-19 20.39,106.41 arc-14 20.04,106.35 20.48,105.14 19.6,105.14 19.17,106.36 17.89,106.36 17.58,105.14 16.7,105.14
LOGO-X
  pour Top (no thermals): 0.83,105.14 1.81,105.14 2.92,106.17 3.49,105.14 4.53,105.14 3.59,106.77 5.37,108.39 4.38,108.39 3.26,107.36 2.69,108.39 1.66,108.39 2.59,106.74
N$1
  cutout Route15: 90.81,81.28 90.04,81.28 90.04,17.78 90.81,17.78
N$2
  Top 0.152: J2.38 85.09,72.71 J3.2
N$29
  cutout Route2: 3.81,20.64 0.95,20.64 0.95,30.8 3.81,30.8
N$50
  cutout Route15: 3.81,20.64 0.95,20.64 0.95,30.8 3.81,30.8
N$53
  cutout Top: 3.81,20.64 0.95,20.64 0.95,30.8 3.81,30.8
N$56
  cutout Bottom: 3.81,20.64 0.95,20.64 0.95,30.8 3.81,30.8

### Text on the board
Top: 1
Route2: 2
Route15: 3
Bottom: 4
tNames: XMICRO-LPA | V1.0 2411 | CHRIS WEIR
bNames: JLCJLCJLCJLC